# Altium project Electro_plant.PrjPcb
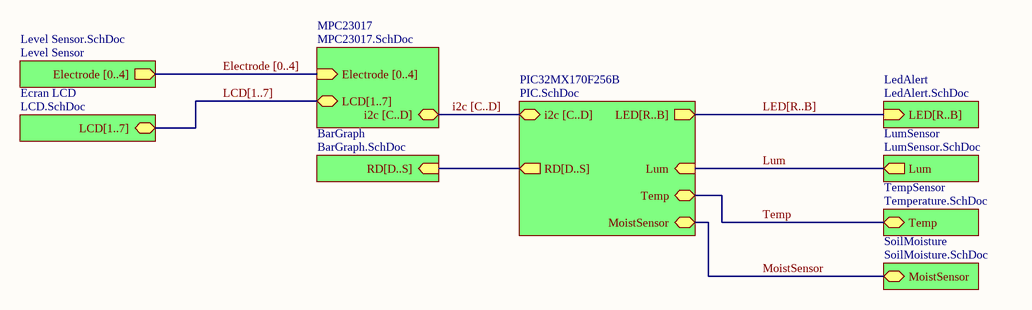
[diagram p0: ElectroPlantoE.SchDoc]
10 sheets, 59 parts. Net scope: hierarchical (ports join the sheet entries above them; power ports are global).
Sheets:
  ElectroPlantoE.SchDoc
    PIC32MX170F256B = PIC.SchDoc
    LedAlert = LedAlert.SchDoc
    LumSensor = LumSensor.SchDoc
    TempSensor = Temperature.SchDoc
    MPC23017 = MPC23017.SchDoc
    Level Sensor = Level Sensor.SchDoc
    Ecran LCD = LCD.SchDoc
    BarGraph = BarGraph.SchDoc
  BlueTooth.SchDoc

## Sheet ElectroPlantoE.SchDoc
size A

### Sub-sheets
BarGraph = BarGraph.SchDoc: RD[D..S] (in)
Ecran LCD = LCD.SchDoc: LCD[1..7] (bidir)
LedAlert = LedAlert.SchDoc: LED[R..B] (in)
Level Sensor = Level Sensor.SchDoc: Electrode [0..4] (out)
LumSensor = LumSensor.SchDoc: Lum (out)
MPC23017 = MPC23017.SchDoc: i2c [C..D] (bidir), Electrode [0..4] (in), LCD[1..7] (bidir)
PIC32MX170F256B = PIC.SchDoc: LED[R..B] (out), Lum (in), Temp, i2c [C..D] (bidir), RD[D..S] (out), MoistSensor
SoilMoisture = SoilMoisture.SchDoc (file not in this document): MoistSensor
TempSensor = Temperature.SchDoc: Temp (bidir)

### Nets
Lum: sheet PIC32MX170F256B/Lum, sheet LumSensor/Lum
MoistSensor: sheet PIC32MX170F256B/MoistSensor, sheet SoilMoisture/MoistSensor
Temp: sheet PIC32MX170F256B/Temp, sheet TempSensor/Temp

### Buses and harness runs
bus Electrode [0..4] = sheet Level Sensor/Electrode [0..4] = sheet MPC23017/Electrode [0..4]
bus i2c [C..D] = sheet MPC23017/i2c [C..D] = sheet PIC32MX170F256B/i2c [C..D]
bus LCD[1..7] = sheet Ecran LCD/LCD[1..7] = sheet MPC23017/LCD[1..7]
bus LED[R..B] = sheet LedAlert/LED[R..B] = sheet PIC32MX170F256B/LED[R..B]
bus sheet BarGraph/RD[D..S] = sheet PIC32MX170F256B/RD[D..S]

## Sheet PIC.SchDoc
size A
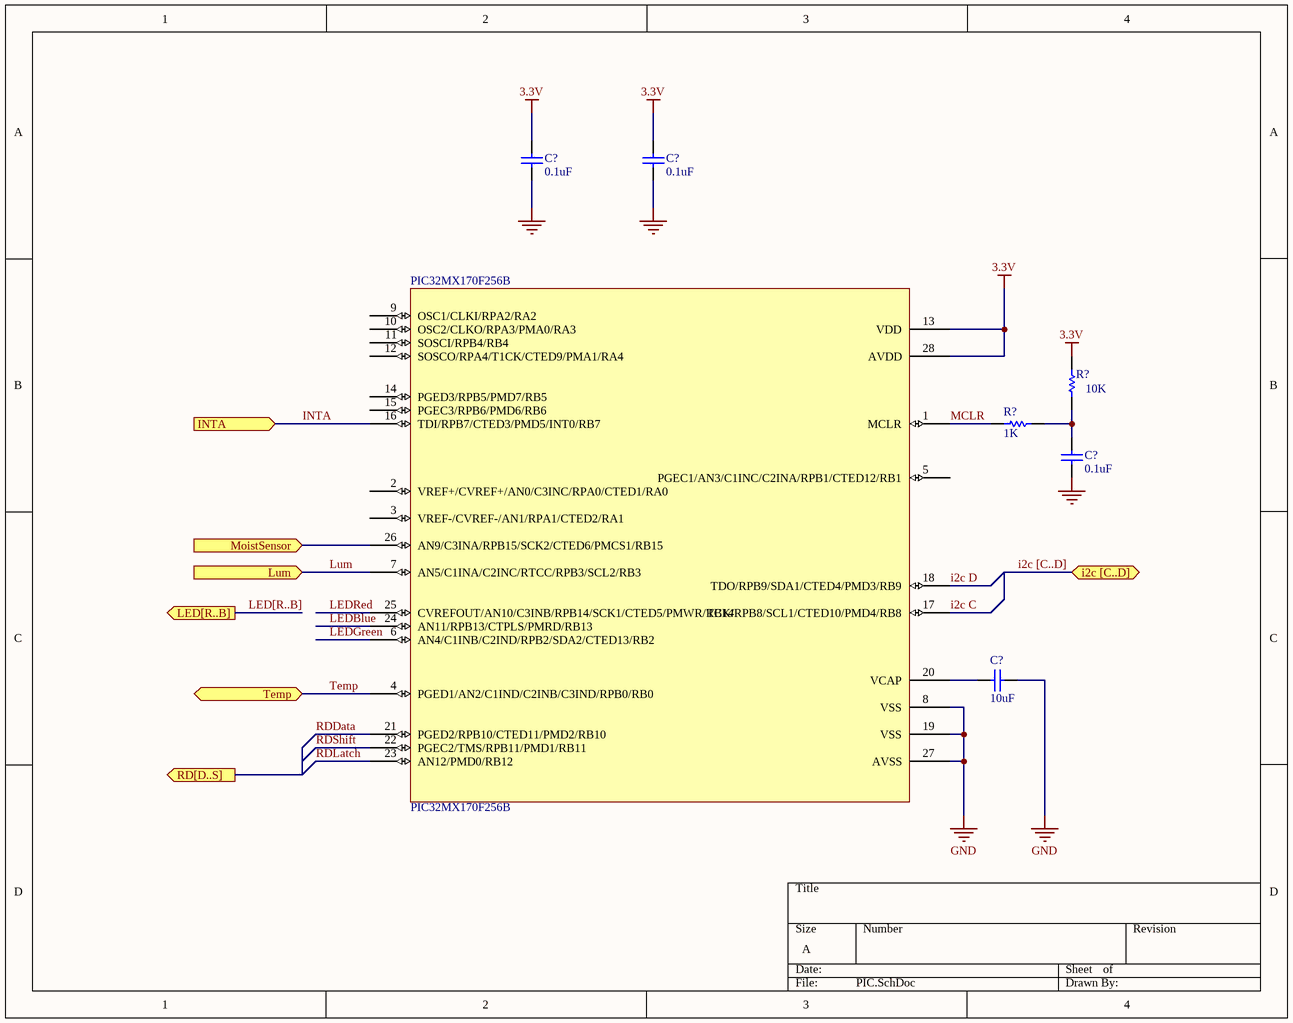
[diagram p1: PIC.SchDoc]

### Parts
(Parts that share a designator on the sheet are numbered #1, #2 ... from top to bottom, then left to right.)
C?#1  0.1uF  [RAD-0.3]
C?#2  0.1uF  [RAD-0.3]
C?#3  0.1uF  [RAD-0.3]
C?#4  10uF  [RAD-0.3]
PIC32MX170F256B  PIC32MX170F256B
R?#1  10K  [AXIAL-0.3]
R?#2  1K  [AXIAL-0.3]

### Ports
i2c [C..D] (bidir), INTA (in), LED[R..B] (out), Lum (in), MoistSensor (in), RD[D..S] (out), Temp (bidir)

### Nets
3.3V: C?#1.1 C?#1.2 C?#2.1 C?#2.2 C?#3.1 C?#4.2 PIC32MX170F256B.8(VSS) PIC32MX170F256B.13(VDD) PIC32MX170F256B.19(VSS) PIC32MX170F256B.27(AVSS) PIC32MX170F256B.28(AVDD) R?#1.2  [also labelled GND]
i2c C: PIC32MX170F256B.17(TCK/RPB8/SCL1/CTED10/PMD4/RB8)
i2c D: PIC32MX170F256B.18(TDO/RPB9/SDA1/CTED4/PMD3/RB9)
INTA: PIC32MX170F256B.16(TDI/RPB7/CTED3/PMD5/INT0/RB7) ; port INTA
LEDBlue: PIC32MX170F256B.24(AN11/RPB13/CTPLS/PMRD/RB13)
LEDGreen: PIC32MX170F256B.6(AN4/C1INB/C2IND/RPB2/SDA2/CTED13/RB2)
LEDRed: PIC32MX170F256B.25(CVREFOUT/AN10/C3INB/RPB14/SCK1/CTED5/PMWR/RB14)
Lum: PIC32MX170F256B.7(AN5/C1INA/C2INC/RTCC/RPB3/SCL2/RB3) ; port Lum
MCLR: PIC32MX170F256B.1(MCLR) R?#2.2
MoistSensor: PIC32MX170F256B.26(AN9/C3INA/RPB15/SCK2/CTED6/PMCS1/RB15) ; port MoistSensor
RDData: PIC32MX170F256B.21(PGED2/RPB10/CTED11/PMD2/RB10)
RDLatch: PIC32MX170F256B.23(AN12/PMD0/RB12)
RDShift: PIC32MX170F256B.22(PGEC2/TMS/RPB11/PMD1/RB11)
Temp: PIC32MX170F256B.4(PGED1/AN2/C1IND/C2INB/C3IND/RPB0/RB0) ; port Temp
NetC?#3_2: C?#3.2 R?#1.1 R?#2.1
NetC?#4_1: C?#4.1 PIC32MX170F256B.20(VCAP)

Not connected (* = marked no-connect by the designer): PIC32MX170F256B 2(VREF+/CVREF+/AN0/C3INC/RPA0/CTED1/RA0) 3(VREF-/CVREF-/AN1/RPA1/CTED2/RA1) 5(PGEC1/AN3/C1INC/C2INA/RPB1/CTED12/RB1) 9(OSC1/CLKI/RPA2/RA2) 10(OSC2/CLKO/RPA3/PMA0/RA3) 11(SOSCI/RPB4/RB4) 12(SOSCO/RPA4/T1CK/CTED9/PMA1/RA4) 14(PGED3/RPB5/PMD7/RB5) 15(PGEC3/RPB6/PMD6/RB6)

### Buses and harness runs
bus i2c [C..D] = port i2c [C..D]
bus LED[R..B] = port LED[R..B]

### Library data of the parts
C?#1-C?#4 = Cap: Capacitor; Value: 100pF; Published: 8-Jun-2000; LatestRevisionDate: 17-Jul-2002; LatestRevisionNote: Re-released for DXP Platform.; PackageReference: RAD-0.3; Publisher: Altium Limited; PackageDescription: Radial Cap, Thru-Hole; 2 Leads; 0.3 in Pin Spacing
R?#1 = Res1: Resistor; Value: 1K; Published: 8-Jun-2000; LatestRevisionDate: 17-Jul-2002; LatestRevisionNote: Re-released for DXP Platform.; PackageReference: AXIAL-0.3; Publisher: Altium Limited; PackageDescription: Axial Device, Thru-Hole; 2 Leads; 0.3 in Pin Spacing
R?#2 = Res1: Resistor; Published: 8-Jun-2000; LatestRevisionDate: 17-Jul-2002; LatestRevisionNote: Re-released for DXP Platform.; PackageReference: AXIAL-0.3; Publisher: Altium Limited; PackageDescription: Axial Device, Thru-Hole; 2 Leads; 0.3 in Pin Spacing; Value: 1K

## Sheet LedAlert.SchDoc
size A
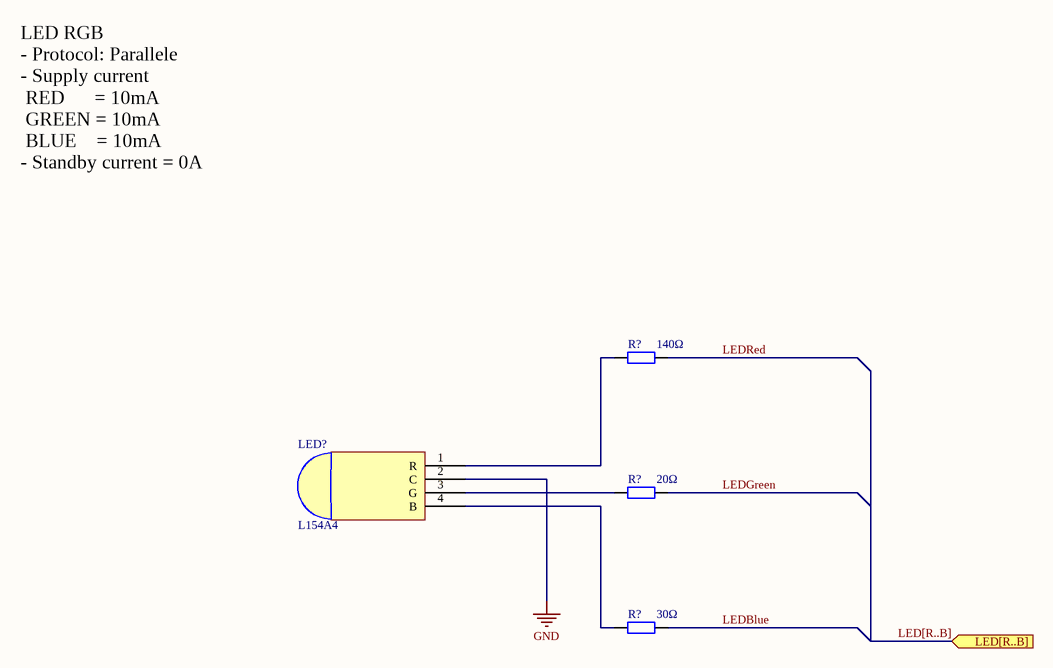
[diagram p2: LedAlert.SchDoc]

### Parts
(Parts that share a designator on the sheet are numbered #1, #2 ... from top to bottom, then left to right.)
LED?  L154A4
R?#3  140Ω  [AXIAL-0.4]
R?#4  20Ω  [AXIAL-0.4]
R?#5  30Ω  [AXIAL-0.4]

### Ports
LED[R..B] (in)

### Nets
GND: LED?.2(C)  [project net 3.3V]
LEDBlue: R?#5.1
LEDGreen: R?#4.1
LEDRed: R?#3.1
NetLED?_1: LED?.1(R) R?#3.2
NetLED?_3: LED?.3(G) R?#4.2
NetLED?_4: LED?.4(B) R?#5.2

### Buses and harness runs
bus LED[R..B] = port LED[R..B]

### Notes on the sheet
- LED RGB
  - Protocol: Parallele
  - Supply current
  RED      = 10mA
  GREEN = 10mA
  BLUE    = 10mA
  - Standby current = 0A

### Library data of the parts
LED? = Component_1
R?#3-R?#5 = Res2: Resistor; Value: 1K; Published: 8-Jun-2000; LatestRevisionDate: 17-Jul-2002; LatestRevisionNote: Re-released for DXP Platform.; PackageReference: AXIAL-0.4; Publisher: Altium Limited; PackageDescription: Axial Device, Thru-Hole; 2 Leads; 0.4 in Pin Spacing

## Sheet LumSensor.SchDoc
size A
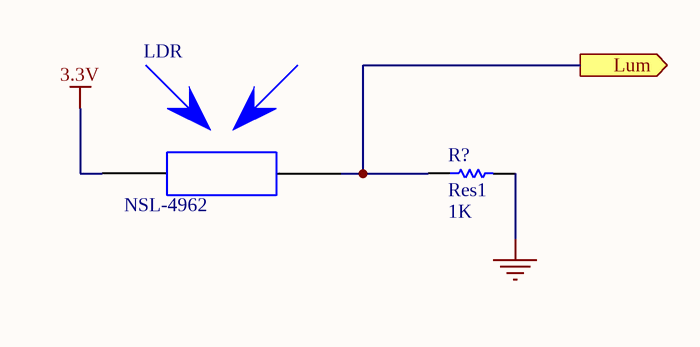
[diagram p3: LumSensor.SchDoc]

### Parts
(Parts that share a designator on the sheet are numbered #1, #2 ... from top to bottom, then left to right.)
LDR  NSL-4962
R?#6  Res1  value 1K  [AXIAL-0.3]

### Ports
Lum (out)

### Nets
3.3V: LDR.1 R?#6.2  [also labelled GND]
Lum: LDR.2 R?#6.1 ; port Lum

### Library data of the parts
R?#6 = Res1: Resistor; Published: 8-Jun-2000; LatestRevisionDate: 17-Jul-2002; LatestRevisionNote: Re-released for DXP Platform.; PackageReference: AXIAL-0.3; Publisher: Altium Limited; PackageDescription: Axial Device, Thru-Hole; 2 Leads; 0.3 in Pin Spacing

## Sheet Temperature.SchDoc
size A
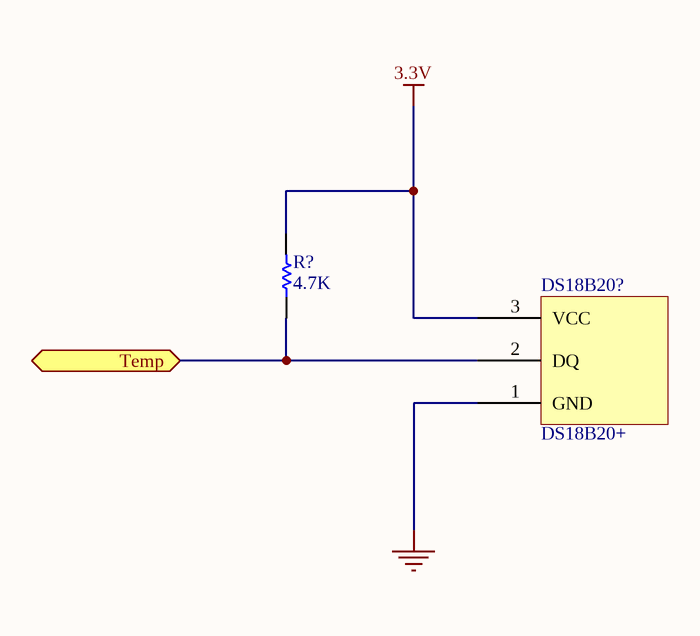
[diagram p4: Temperature.SchDoc]

### Parts
(Parts that share a designator on the sheet are numbered #1, #2 ... from top to bottom, then left to right.)
DS18B20?  DS18B20+
R?#7  4.7K  [AXIAL-0.3]

### Ports
Temp (bidir)

### Nets
3.3V: DS18B20?.1(GND) DS18B20?.3(VCC) R?#7.2  [also labelled GND]
Temp: DS18B20?.2(DQ) R?#7.1 ; port Temp

### Library data of the parts
R?#7 = Res1: Resistor; Value: 1K; Published: 8-Jun-2000; LatestRevisionDate: 17-Jul-2002; LatestRevisionNote: Re-released for DXP Platform.; PackageReference: AXIAL-0.3; Publisher: Altium Limited; PackageDescription: Axial Device, Thru-Hole; 2 Leads; 0.3 in Pin Spacing

## Sheet MPC23017.SchDoc
size A
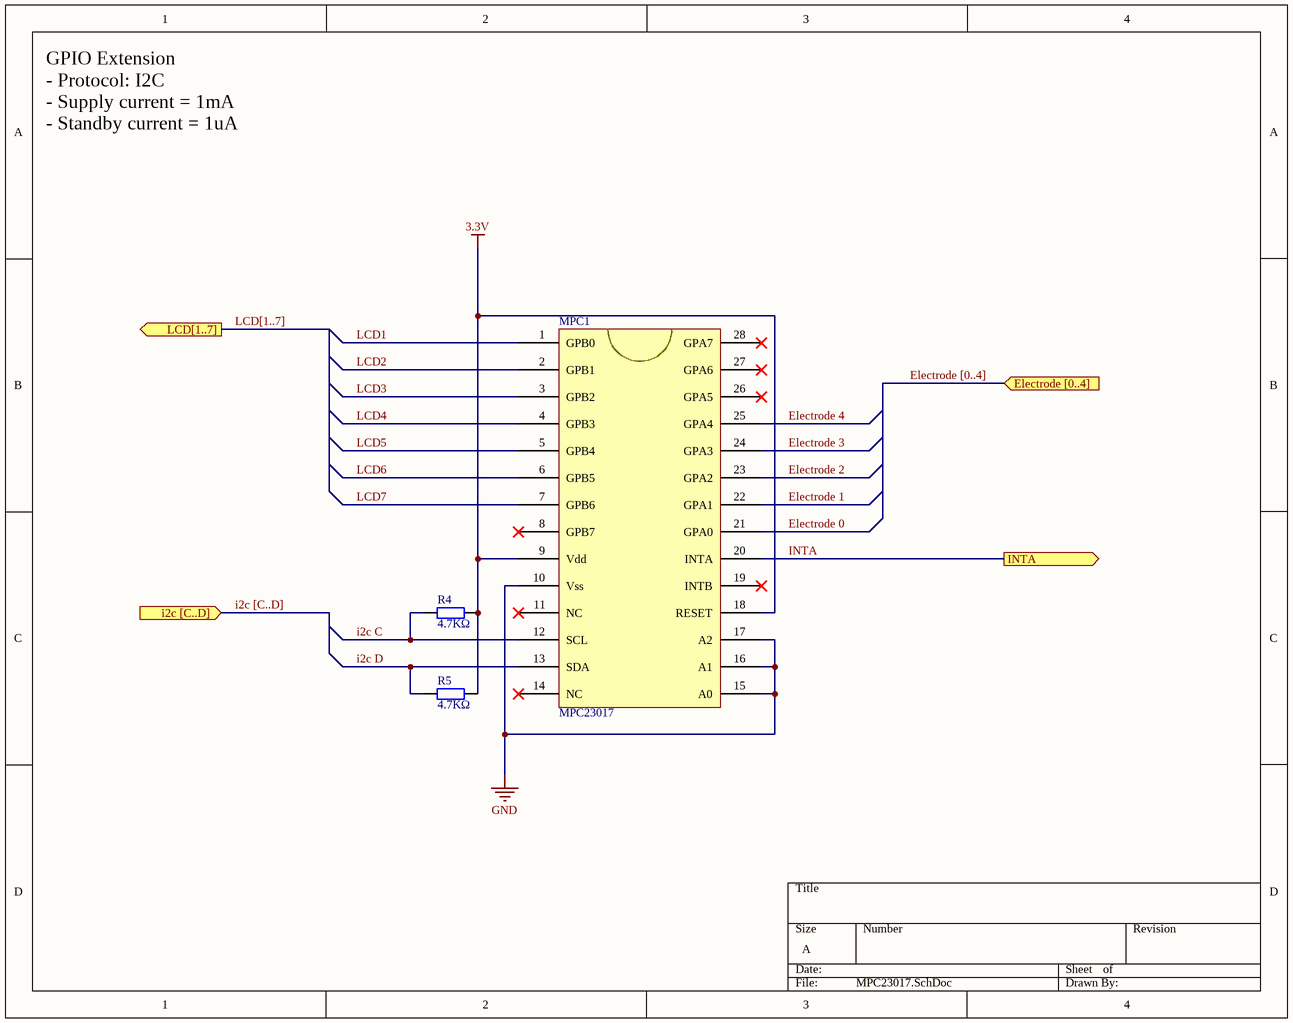
[diagram p5: MPC23017.SchDoc]

### Parts
MPC1  MPC23017
R4  4.7KΩ  [AXIAL-0.4]
R5  4.7KΩ  [AXIAL-0.4]

### Ports
Electrode [0..4] (in), i2c [C..D] (in), INTA (out), LCD[1..7] (out)

### Nets
3.3V: MPC1.9(Vdd) MPC1.10(Vss) MPC1.15(A0) MPC1.16(A1) MPC1.17(A2) MPC1.18(RESET) R4.1 R5.1  [also labelled GND]
Electrode 0: MPC1.21(GPA0)
Electrode 1: MPC1.22(GPA1)
Electrode 2: MPC1.23(GPA2)
Electrode 3: MPC1.24(GPA3)
Electrode 4: MPC1.25(GPA4)
i2c C: MPC1.12(SCL) R4.2
i2c D: MPC1.13(SDA) R5.2
INTA: MPC1.20(INTA) ; port INTA
LCD1: MPC1.1(GPB0)
LCD2: MPC1.2(GPB1)
LCD3: MPC1.3(GPB2)
LCD4: MPC1.4(GPB3)
LCD5: MPC1.5(GPB4)
LCD6: MPC1.6(GPB5)
LCD7: MPC1.7(GPB6)

Not connected (* = marked no-connect by the designer): MPC1 8(GPB7)* 11(NC)* 14(NC)* 19(INTB)* 26(GPA5)* 27(GPA6)* 28(GPA7)*

### Buses and harness runs
bus Electrode [0..4] = port Electrode [0..4]
bus i2c [C..D] = port i2c [C..D]
bus LCD[1..7] = port LCD[1..7]

### Notes on the sheet
- GPIO Extension
  - Protocol: I2C
  - Supply current = 1mA
  - Standby current = 1uA

### Library data of the parts
MPC1 = Component_1
R4 R5 = Res2: Resistor; Value: 1K; Published: 8-Jun-2000; LatestRevisionDate: 17-Jul-2002; LatestRevisionNote: Re-released for DXP Platform.; PackageReference: AXIAL-0.4; Publisher: Altium Limited; PackageDescription: Axial Device, Thru-Hole; 2 Leads; 0.4 in Pin Spacing

## Sheet Level Sensor.SchDoc
size A
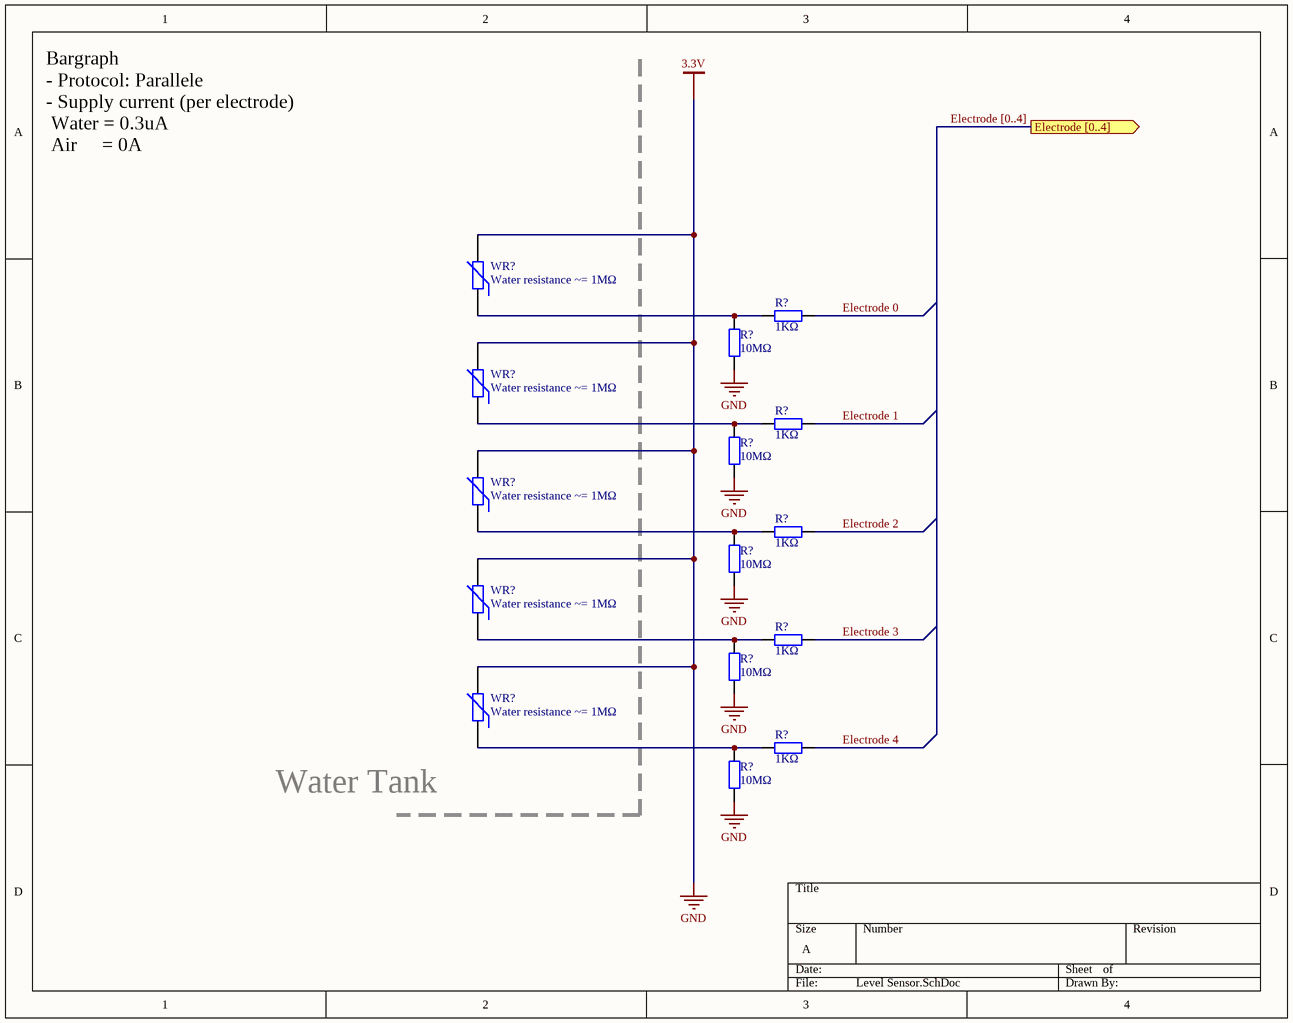
[diagram p6: Level Sensor.SchDoc]

### Parts
(Parts that share a designator on the sheet are numbered #1, #2 ... from top to bottom, then left to right.)
R?#8  1KΩ  [AXIAL-0.4]
R?#9  10MΩ  [AXIAL-0.4]
R?#10  1KΩ  [AXIAL-0.4]
R?#11  10MΩ  [AXIAL-0.4]
R?#12  1KΩ  [AXIAL-0.4]
R?#13  10MΩ  [AXIAL-0.4]
R?#14  1KΩ  [AXIAL-0.4]
R?#15  10MΩ  [AXIAL-0.4]
R?#16  1KΩ  [AXIAL-0.4]
R?#17  10MΩ  [AXIAL-0.4]
WR?#1  Water resistance ~= 1MΩ  [6-0805_N]
WR?#2  Water resistance ~= 1MΩ  [6-0805_N]
WR?#3  Water resistance ~= 1MΩ  [6-0805_N]
WR?#4  Water resistance ~= 1MΩ  [6-0805_N]
WR?#5  Water resistance ~= 1MΩ  [6-0805_N]

### Ports
Electrode [0..4] (out)

### Nets
3.3V: R?#9.1 R?#11.1 R?#13.1 R?#15.1 R?#17.1 WR?#1.2 WR?#2.2 WR?#3.2 WR?#4.2 WR?#5.2  [also labelled GND]
Electrode 0: R?#8.1
Electrode 1: R?#10.1
Electrode 2: R?#12.1
Electrode 3: R?#14.1
Electrode 4: R?#16.1
NetR?#8_2: R?#8.2 R?#9.2 WR?#1.1
NetR?#10_2: R?#10.2 R?#11.2 WR?#2.1
NetR?#12_2: R?#12.2 R?#13.2 WR?#3.1
NetR?#14_2: R?#14.2 R?#15.2 WR?#4.1
NetR?#16_2: R?#16.2 R?#17.2 WR?#5.1

### Buses and harness runs
bus Electrode [0..4] = port Electrode [0..4]

### Notes on the sheet
- Bargraph
  - Protocol: Parallele
  - Supply current (per electrode)
  Water = 0.3uA
  Air     = 0A
- Water Tank

### Library data of the parts
R?#8-R?#17 = Res2: Resistor; Value: 1K; Published: 8-Jun-2000; LatestRevisionDate: 17-Jul-2002; LatestRevisionNote: Re-released for DXP Platform.; PackageReference: AXIAL-0.4; Publisher: Altium Limited; PackageDescription: Axial Device, Thru-Hole; 2 Leads; 0.4 in Pin Spacing
WR?#1-WR?#5 = Res Varistor: Varistor (Voltage-Sensitive Resistor); Published: 24-Mar-1999; LatestRevisionDate: 29-May-2009; LatestRevisionNote: IPC-7351 Footprint Added.; PackageVersion: Mar-2003; PackageReference: 6-0805; Publisher: Altium Limited; PackageDescription: Chip Resistor 0805 Case Size; Code_IPC: RESC2012

## Sheet LCD.SchDoc
size A
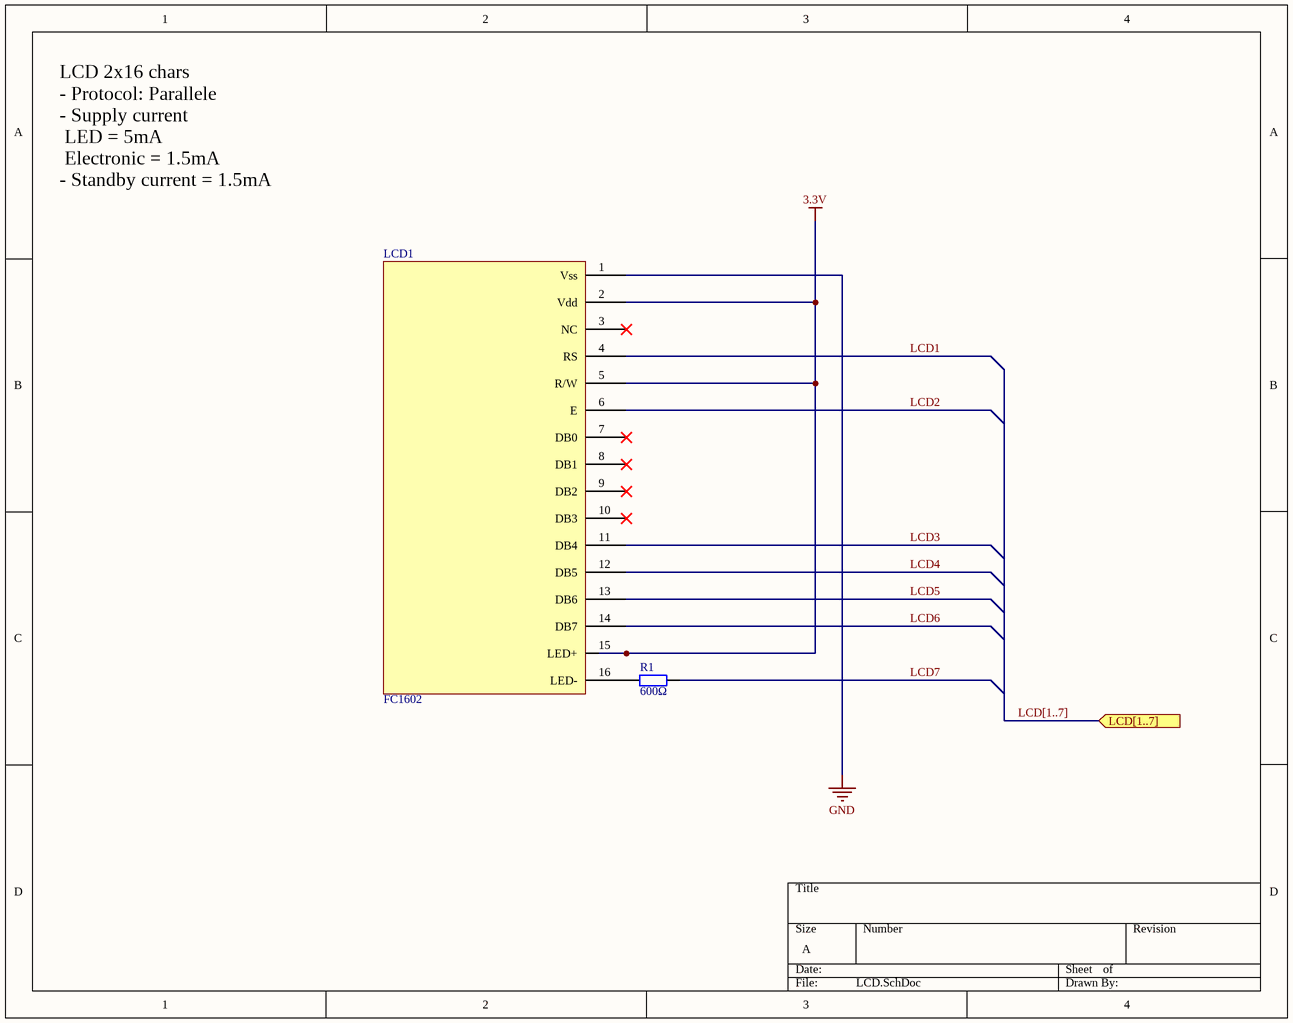
[diagram p7: LCD.SchDoc]

### Parts
LCD1  FC1602
R1  600Ω  [AXIAL-0.4]

### Ports
LCD[1..7] (in)

### Nets
3.3V: LCD1.1(Vss) LCD1.2(Vdd) LCD1.5(R/W) LCD1.15(LED+)  [also labelled GND]
LCD1: LCD1.4(RS)
LCD2: LCD1.6(E)
LCD3: LCD1.11(DB4)
LCD4: LCD1.12(DB5)
LCD5: LCD1.13(DB6)
LCD6: LCD1.14(DB7)
LCD7: R1.1
NetLCD1_16: LCD1.16(LED-) R1.2

Not connected (* = marked no-connect by the designer): LCD1 3(NC)* 7(DB0)* 8(DB1)* 9(DB2)* 10(DB3)*

### Buses and harness runs
bus LCD[1..7] =  = port LCD[1..7]

### Notes on the sheet
- LCD 2x16 chars
  - Protocol: Parallele
  - Supply current
  LED	= 5mA
  Electronic	= 1.5mA
  - Standby current = 1.5mA

### Library data of the parts
LCD1 = Component_1
R1 = Res2: Resistor; Value: 1K; Published: 8-Jun-2000; LatestRevisionDate: 17-Jul-2002; LatestRevisionNote: Re-released for DXP Platform.; PackageReference: AXIAL-0.4; Publisher: Altium Limited; PackageDescription: Axial Device, Thru-Hole; 2 Leads; 0.4 in Pin Spacing

## Sheet BarGraph.SchDoc
size A
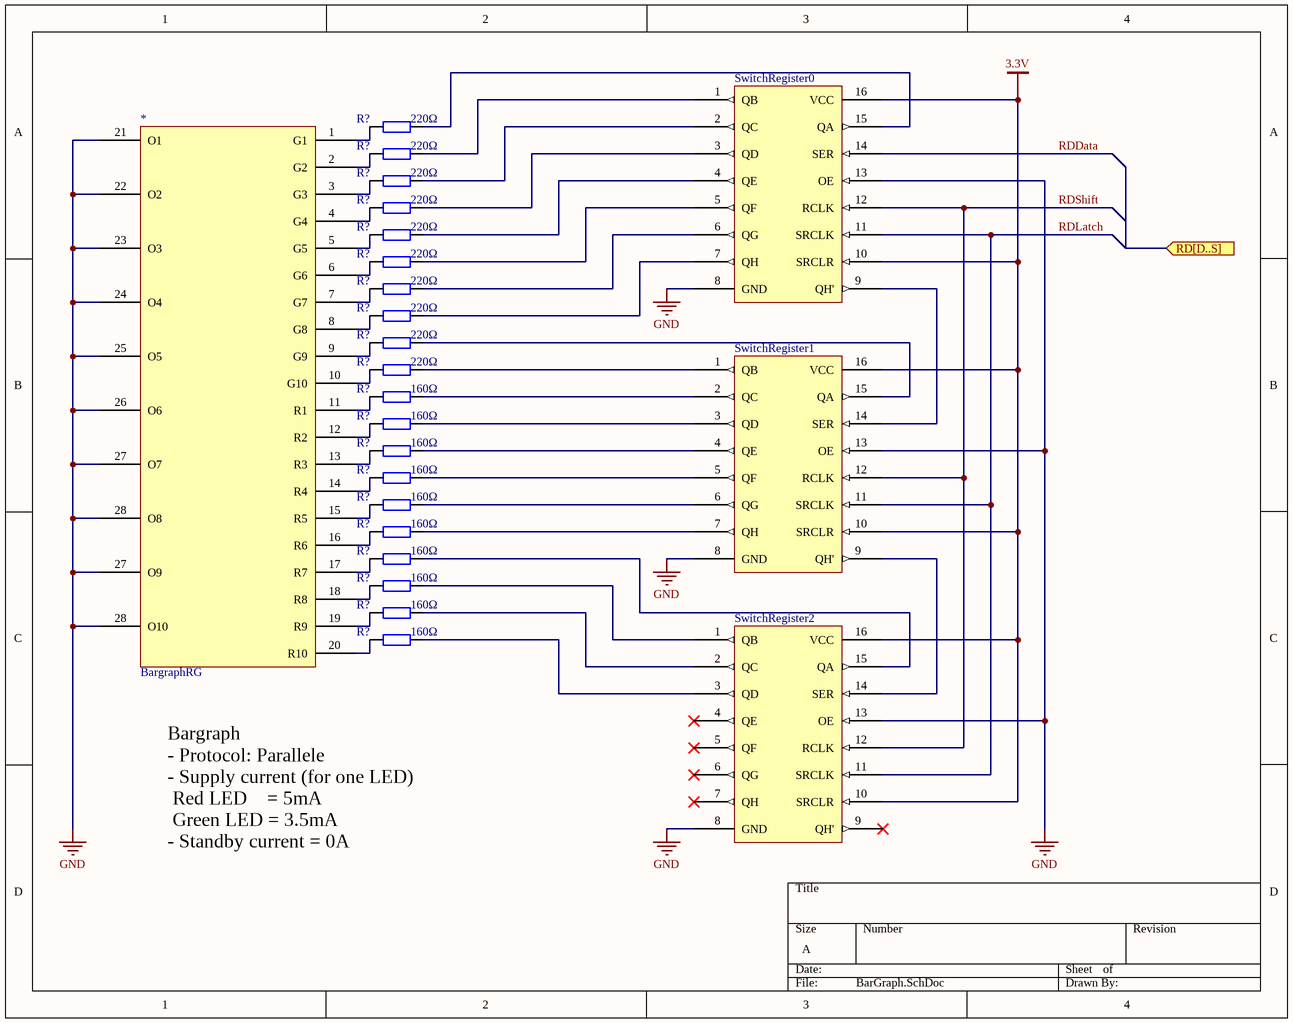
[diagram p8: BarGraph.SchDoc]

### Parts
(Parts that share a designator on the sheet are numbered #1, #2 ... from top to bottom, then left to right.)
*  BargraphRG
R?#18  220Ω  [AXIAL-0.4]
R?#19  220Ω  [AXIAL-0.4]
R?#20  220Ω  [AXIAL-0.4]
R?#21  220Ω  [AXIAL-0.4]
R?#22  220Ω  [AXIAL-0.4]
R?#23  220Ω  [AXIAL-0.4]
R?#24  220Ω  [AXIAL-0.4]
R?#25  220Ω  [AXIAL-0.4]
R?#26  220Ω  [AXIAL-0.4]
R?#27  220Ω  [AXIAL-0.4]
R?#28  160Ω  [AXIAL-0.4]
R?#29  160Ω  [AXIAL-0.4]
R?#30  160Ω  [AXIAL-0.4]
R?#31  160Ω  [AXIAL-0.4]
R?#32  160Ω  [AXIAL-0.4]
R?#33  160Ω  [AXIAL-0.4]
R?#34  160Ω  [AXIAL-0.4]
R?#35  160Ω  [AXIAL-0.4]
R?#36  160Ω  [AXIAL-0.4]
R?#37  160Ω  [AXIAL-0.4]
SwitchRegister0  (no value)
SwitchRegister1  (no value)
SwitchRegister2  (no value)

### Ports
RD[D..S] (in)

### Nets
3.3V: *.21(O1) *.22(O2) *.23(O3) *.24(O4) *.25(O5) *.26(O6) *.27(O7) *.28(O8) SwitchRegister0.8(GND) SwitchRegister0.10(SRCLR) SwitchRegister0.13(OE) SwitchRegister0.16(VCC) SwitchRegister1.8(GND) SwitchRegister1.10(SRCLR) SwitchRegister1.13(OE) SwitchRegister1.16(VCC) SwitchRegister2.8(GND) SwitchRegister2.10(SRCLR) SwitchRegister2.13(OE) SwitchRegister2.16(VCC)  [also labelled GND]
RDData: SwitchRegister0.14(SER)
RDLatch: SwitchRegister0.11(SRCLK) SwitchRegister1.11(SRCLK) SwitchRegister2.11(SRCLK)
RDShift: SwitchRegister0.12(RCLK) SwitchRegister1.12(RCLK) SwitchRegister2.12(RCLK)
Net*_1: *.1(G1) R?#18.1
Net*_2: *.2(G2) R?#19.1
Net*_3: *.3(G3) R?#20.1
Net*_4: *.4(G4) R?#21.1
Net*_5: *.5(G5) R?#22.1
Net*_6: *.6(G6) R?#23.1
Net*_7: *.7(G7) R?#24.1
Net*_8: *.8(G8) R?#25.1
Net*_9: *.9(G9) R?#26.1
Net*_10: *.10(G10) R?#27.1
Net*_11: *.11(R1) R?#28.1
Net*_12: *.12(R2) R?#29.1
Net*_13: *.13(R3) R?#30.1
Net*_14: *.14(R4) R?#31.1
Net*_15: *.15(R5) R?#32.1
Net*_16: *.16(R6) R?#33.1
Net*_17: *.17(R7) R?#34.1
Net*_18: *.18(R8) R?#35.1
Net*_19: *.19(R9) R?#36.1
Net*_20: *.20(R10) R?#37.1
NetR?#18_2: R?#18.2 SwitchRegister0.15(QA)
NetR?#19_2: R?#19.2 SwitchRegister0.1(QB)
NetR?#20_2: R?#20.2 SwitchRegister0.2(QC)
NetR?#21_2: R?#21.2 SwitchRegister0.3(QD)
NetR?#22_2: R?#22.2 SwitchRegister0.4(QE)
NetR?#23_2: R?#23.2 SwitchRegister0.5(QF)
NetR?#24_2: R?#24.2 SwitchRegister0.6(QG)
NetR?#25_2: R?#25.2 SwitchRegister0.7(QH)
NetR?#26_2: R?#26.2 SwitchRegister1.15(QA)
NetR?#27_2: R?#27.2 SwitchRegister1.1(QB)
NetR?#28_2: R?#28.2 SwitchRegister1.2(QC)
NetR?#29_2: R?#29.2 SwitchRegister1.3(QD)
NetR?#30_2: R?#30.2 SwitchRegister1.4(QE)
NetR?#31_2: R?#31.2 SwitchRegister1.5(QF)
NetR?#32_2: R?#32.2 SwitchRegister1.6(QG)
NetR?#33_2: R?#33.2 SwitchRegister1.7(QH)
NetR?#34_2: R?#34.2 SwitchRegister2.15(QA)
NetR?#35_2: R?#35.2 SwitchRegister2.1(QB)
NetR?#36_2: R?#36.2 SwitchRegister2.2(QC)
NetR?#37_2: R?#37.2 SwitchRegister2.3(QD)
NetSwitchRegister0_9: SwitchRegister0.9(QH') SwitchRegister1.14(SER)
NetSwitchRegister1_9: SwitchRegister1.9(QH') SwitchRegister2.14(SER)

Not connected (* = marked no-connect by the designer): SwitchRegister2 4(QE)* 5(QF)* 6(QG)* 7(QH)* 9(QH')*

### Notes on the sheet
- Bargraph
  - Protocol: Parallele
  - Supply current (for one LED)
  Red LED    = 5mA
  Green LED = 3.5mA
  - Standby current = 0A

### Library data of the parts
R?#18-R?#37 = Res2: Resistor; Value: 1K; Published: 8-Jun-2000; LatestRevisionDate: 17-Jul-2002; LatestRevisionNote: Re-released for DXP Platform.; PackageReference: AXIAL-0.4; Publisher: Altium Limited; PackageDescription: Axial Device, Thru-Hole; 2 Leads; 0.4 in Pin Spacing
SwitchRegister0-SwitchRegister2 = Component_1

## Sheet BlueTooth.SchDoc
size A

## Nets that join several sheets
3.3V: PIC (12 pins), LedAlert (LED?.2), LumSensor (LDR.1 R?#6.2), Temperature (DS18B20?.1 DS18B20?.3 R?#7.2), MPC23017 (8 pins), Level Sensor (10 pins), LCD (LCD1.1 LCD1.2 LCD1.5 LCD1.15), BarGraph (20 pins)
Electrode 0: MPC23017 (MPC1.21), Level Sensor (R?#8.1)
Electrode 1: MPC23017 (MPC1.22), Level Sensor (R?#10.1)
Electrode 2: MPC23017 (MPC1.23), Level Sensor (R?#12.1)
Electrode 3: MPC23017 (MPC1.24), Level Sensor (R?#14.1)
Electrode 4: MPC23017 (MPC1.25), Level Sensor (R?#16.1)
LCD1: MPC23017 (MPC1.1), LCD (LCD1.4)
LCD2: MPC23017 (MPC1.2), LCD (LCD1.6)
LCD3: MPC23017 (MPC1.3), LCD (LCD1.11)
LCD4: MPC23017 (MPC1.4), LCD (LCD1.12)
LCD5: MPC23017 (MPC1.5), LCD (LCD1.13)
LCD6: MPC23017 (MPC1.6), LCD (LCD1.14)
LCD7: MPC23017 (MPC1.7), LCD (R1.1)
Lum: PIC (PIC32MX170F256B.7), LumSensor (LDR.2 R?#6.1)
Temp: PIC (PIC32MX170F256B.4), Temperature (DS18B20?.2 R?#7.1)